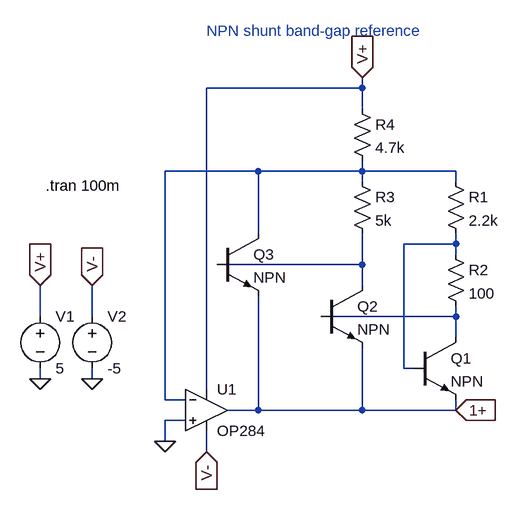
[diagram p0: schematic npn_shunt_bandgap_reference.asc]
npn_shunt_bandgap_reference.asc, the LTspice schematic file:
Version 4
SHEET 1 900 680
WIRE 592 -432 592 -448
WIRE 592 -432 352 -432
WIRE 592 -400 592 -432
WIRE 432 -304 288 -304
WIRE 592 -304 592 -320
WIRE 592 -304 432 -304
WIRE 736 -304 592 -304
WIRE 592 -288 592 -304
WIRE 736 -288 736 -304
WIRE 432 -208 432 -304
WIRE 736 -192 736 -208
WIRE 736 -192 656 -192
WIRE 736 -176 736 -192
WIRE 592 -160 592 -208
WIRE 592 -160 368 -160
WIRE 592 -128 592 -160
WIRE 96 -80 96 -128
WIRE 176 -80 176 -128
WIRE 736 -80 736 -96
WIRE 736 -80 528 -80
WIRE 736 -48 736 -80
WIRE 656 0 656 -192
WIRE 672 0 656 0
WIRE 96 16 96 0
WIRE 176 16 176 0
WIRE 352 32 352 -432
WIRE 288 48 288 -304
WIRE 320 48 288 48
WIRE 432 64 432 -112
WIRE 432 64 384 64
WIRE 592 64 592 -32
WIRE 592 64 432 64
WIRE 736 64 736 48
WIRE 736 64 592 64
WIRE 320 80 288 80
WIRE 288 112 288 80
WIRE 352 128 352 96
FLAG 96 16 0
FLAG 96 -128 V+
IOPIN 96 -128 In
FLAG 176 16 0
FLAG 176 -128 V-
IOPIN 176 -128 In
FLAG 288 112 0
FLAG 352 128 V-
IOPIN 352 128 In
FLAG 592 -448 V+
IOPIN 592 -448 In
FLAG 736 64 1+
IOPIN 736 64 In
SYMBOL voltage 96 -96 R0
WINDOW 123 0 0 Left 0
WINDOW 39 0 0 Left 0
SYMATTR InstName V1
SYMATTR Value 5
SYMBOL voltage 176 -96 R0
WINDOW 123 0 0 Left 0
WINDOW 39 0 0 Left 0
SYMATTR InstName V2
SYMATTR Value -5
SYMBOL Opamps\\OP284 352 0 R0
SYMATTR InstName U1
SYMBOL res 720 -304 R0
SYMATTR InstName R1
SYMATTR Value 2.2k
SYMBOL res 720 -192 R0
SYMATTR InstName R2
SYMATTR Value 100
SYMBOL res 576 -304 R0
SYMATTR InstName R3
SYMATTR Value 5k
SYMBOL res 576 -416 R0
SYMATTR InstName R4
SYMATTR Value 4.7k
SYMBOL npn 672 -48 R0
SYMATTR InstName Q1
SYMBOL npn 528 -128 R0
SYMATTR InstName Q2
SYMBOL npn 368 -208 R0
SYMATTR InstName Q3
TEXT 104 -282 Left 2 !.tran 100m
TEXT 352 -520 Left 2 ;NPN shunt band-gap reference

The netlist it stands for:
* npn_shunt_bandgap_reference.asc
V1 V+ 0 5
V2 V- 0 -5
XU1 0 N001 V+ V- 1+ OP284  ; pins In+ In- V+ V- OUT
R1 N001 N002 2.2k
R2 N002 N004 100
R3 N001 N003 5k
R4 V+ N001 4.7k
Q1 N004 N002 1+ 0 NPN
Q2 N003 N004 1+ 0 NPN
Q3 N001 N003 1+ 0 NPN
.model NPN NPN
.model PNP PNP
.lib standard.bjt
.tran 100m
* NPN shunt band-gap reference
.lib ADI1.lib
.backanno
.end